# Altium schematic sheet PCI short card universal - 32 BIT.schdoc: PCI short card universal - 32 BIT
size A; Organization: Organization; Address1: Address1; Address2: Address2; Address3: Address3; Address4: Address4; DocumentNumber: 1; Revision: 0; SheetNumber: 2; SheetTotal: 2
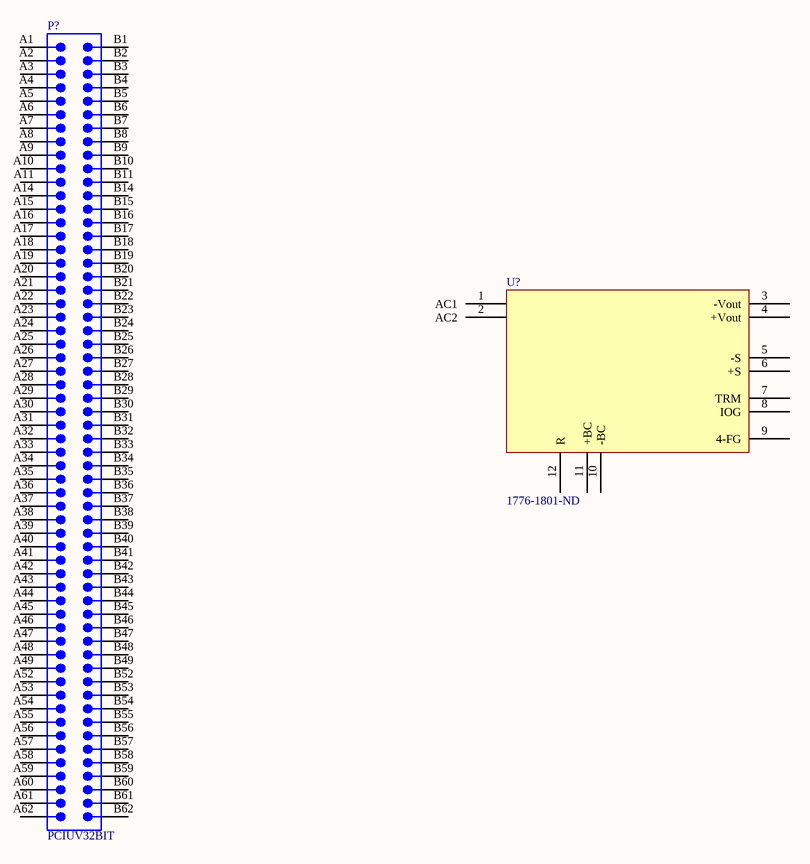
[diagram p0: PCI short card universal - 32 BIT.schdoc]

## Parts
P?  PCIUV32BIT  [PCIUV32BIT]
U?  Supplier Part Number 1: 1776-1801-ND  [TUNS300F28]  (hidden comment: TUNS300F28)

## Nets

Not connected (* = marked no-connect by the designer): P? A1 A2 A3 A4 A5 A6 A7 A8 A9 A10 A11 A14 A15 A16 A17 A18 A19 A20 A21 A22 A23 A24 A25 A26 A27 A28 A29 A30 A31 A32 A33 A34 A35 A36 A37 A38 A39 A40 A41 A42 A43 A44 A45 A46 A47 A48 A49 A52 A53 A54 A55 A56 A57 A58 A59 A60 A61 A62 B1 B2 B3 B4 B5 B6 B7 B8 B9 B10 B11 B14 B15 B16 B17 B18 B19 B20 B21 B22 B23 B24 B25 B26 B27 B28 B29 B30 B31 B32 B33 B34 B35 B36 B37 B38 B39 B40 B41 B42 B43 B44 B45 B46 B47 B48 B49 B52 B53 B54 B55 B56 B57 B58 B59 B60 B61 B62; U? 1(AC1) 2(AC2) 3(-Vout) 4(+Vout) 5(-S) 6(+S) 7(TRM) 8(IOG) 9(4-FG) 10(-BC) 11(+BC) 12(R)

## Library data of the parts
P? = PCIUV32BIT: Card, 116-Position; Text Field6: Pins A12, A13, B12, B13, A50, A51, B50 & B51 are not present.  Alternate Layout Available; Text Field7: Published 14-Feb-2002
U? = TUNS300F28: Supplier 1: Digi-Key